# Altium project HeartBlink v1.1.PrjPCB
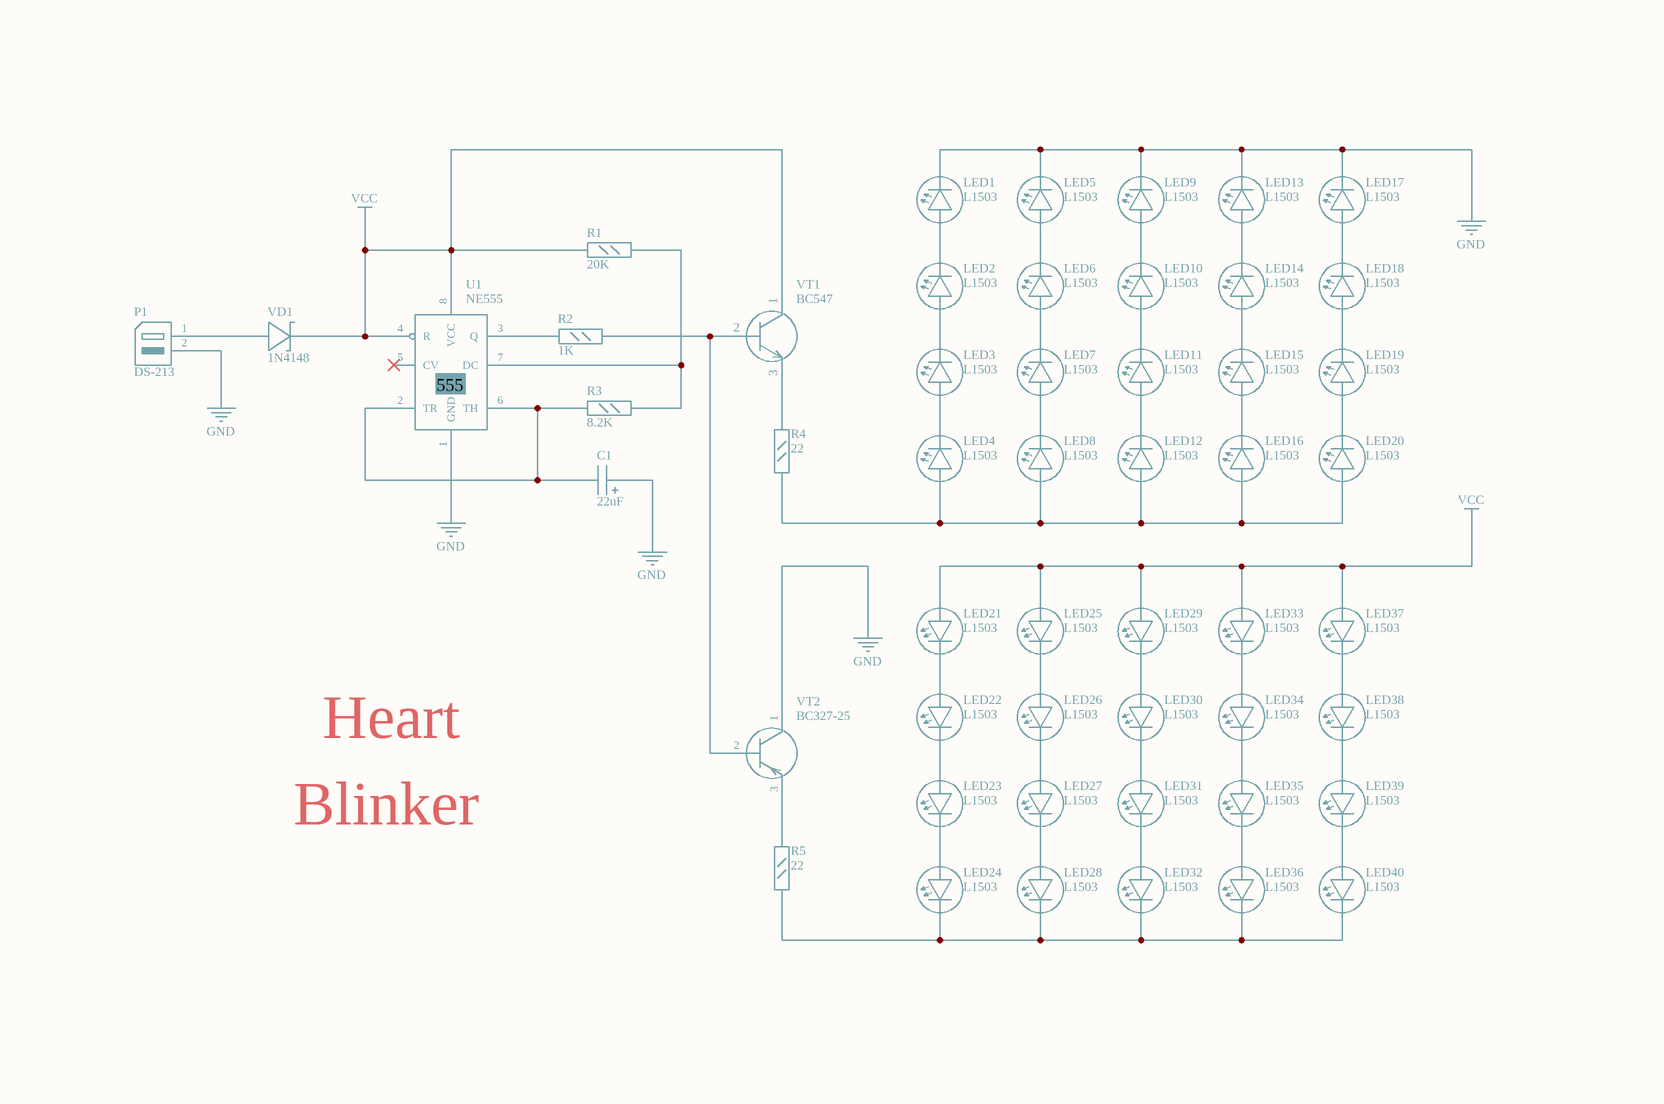
[diagram p0: HeartBlink.SchDoc]
1 sheet, 51 parts. Net scope: global (net labels, ports and power ports of the same name join across sheets).
Board file: HeartBlink.PcbDoc

## Sheet HeartBlink.SchDoc
size A4

### Parts
C1  22uF  [CAP_POL5]
LED1  L1503  [LED2.54-5MM-RED]
LED2  L1503  [LED2.54-5MM-RED]
LED3  L1503  [LED2.54-5MM-RED]
LED4  L1503  [LED2.54-5MM-RED]
LED5  L1503  [LED2.54-5MM-RED]
LED6  L1503  [LED2.54-5MM-RED]
LED7  L1503  [LED2.54-5MM-RED]
LED8  L1503  [LED2.54-5MM-RED]
LED9  L1503  [LED2.54-5MM-RED]
LED10  L1503  [LED2.54-5MM-RED]
LED11  L1503  [LED2.54-5MM-RED]
LED12  L1503  [LED2.54-5MM-RED]
LED13  L1503  [LED2.54-5MM-RED]
LED14  L1503  [LED2.54-5MM-RED]
LED15  L1503  [LED2.54-5MM-RED]
LED16  L1503  [LED2.54-5MM-RED]
LED17  L1503  [LED2.54-5MM-RED]
LED18  L1503  [LED2.54-5MM-RED]
LED19  L1503  [LED2.54-5MM-RED]
LED20  L1503  [LED2.54-5MM-RED]
LED21  L1503  [LED2.54-5MM-RED]
LED22  L1503  [LED2.54-5MM-RED]
LED23  L1503  [LED2.54-5MM-RED]
LED24  L1503  [LED2.54-5MM-RED]
LED25  L1503  [LED2.54-5MM-RED]
LED26  L1503  [LED2.54-5MM-RED]
LED27  L1503  [LED2.54-5MM-RED]
LED28  L1503  [LED2.54-5MM-RED]
LED29  L1503  [LED2.54-5MM-RED]
LED30  L1503  [LED2.54-5MM-RED]
LED31  L1503  [LED2.54-5MM-RED]
LED32  L1503  [LED2.54-5MM-RED]
LED33  L1503  [LED2.54-5MM-RED]
LED34  L1503  [LED2.54-5MM-RED]
LED35  L1503  [LED2.54-5MM-RED]
LED36  L1503  [LED2.54-5MM-RED]
LED37  L1503  [LED2.54-5MM-RED]
LED38  L1503  [LED2.54-5MM-RED]
LED39  L1503  [LED2.54-5MM-RED]
LED40  L1503  [LED2.54-5MM-RED]
P1  DS-213  [ST-213]
R1  20K  [AXIAL10R]
R2  1K  [AXIAL10R]
R3  8.2K  [AXIAL10R]
R4  22  [AXIAL10R]
R5  22  [AXIAL10R]
U1  NE555  [SOIC8]
VD1  1N4148  [AXIAL10D-BL]
VT1  BC547  [TO-92]
VT2  BC327-25  [TO-92]

### Nets
GND: C1.1 LED1.2 LED5.2 LED9.2 LED13.2 LED17.2 P1.2 U1.1(GND) VT2.1
VCC: LED21.1 LED25.1 LED29.1 LED33.1 LED37.1 R1.2 U1.4(R) U1.8(VCC) VD1.2 VT1.1
NetC1_2: C1.2 R3.2 U1.2(TR) U1.6(TH)
NetLED1_1: LED1.1 LED2.2
NetLED2_1: LED2.1 LED3.2
NetLED3_1: LED3.1 LED4.2
NetLED4_1: LED4.1 LED8.1 LED12.1 LED16.1 LED20.1 R4.1
NetLED5_1: LED5.1 LED6.2
NetLED6_1: LED6.1 LED7.2
NetLED7_1: LED7.1 LED8.2
NetLED9_1: LED9.1 LED10.2
NetLED10_1: LED10.1 LED11.2
NetLED11_1: LED11.1 LED12.2
NetLED13_1: LED13.1 LED14.2
NetLED14_1: LED14.1 LED15.2
NetLED15_1: LED15.1 LED16.2
NetLED17_1: LED17.1 LED18.2
NetLED18_1: LED18.1 LED19.2
NetLED19_1: LED19.1 LED20.2
NetLED21_2: LED21.2 LED22.1
NetLED22_2: LED22.2 LED23.1
NetLED23_2: LED23.2 LED24.1
NetLED24_2: LED24.2 LED28.2 LED32.2 LED36.2 LED40.2 R5.1
NetLED25_2: LED25.2 LED26.1
NetLED26_2: LED26.2 LED27.1
NetLED27_2: LED27.2 LED28.1
NetLED29_2: LED29.2 LED30.1
NetLED30_2: LED30.2 LED31.1
NetLED31_2: LED31.2 LED32.1
NetLED33_2: LED33.2 LED34.1
NetLED34_2: LED34.2 LED35.1
NetLED35_2: LED35.2 LED36.1
NetLED37_2: LED37.2 LED38.1
NetLED38_2: LED38.2 LED39.1
NetLED39_2: LED39.2 LED40.1
NetP1_1: P1.1 VD1.1
NetR1_1: R1.1 R3.1 U1.7(DC)
NetR2_1: R2.1 U1.3(Q)
NetR2_2: R2.2 VT1.2 VT2.2
NetR4_2: R4.2 VT1.3
NetR5_2: R5.2 VT2.3

Not connected (* = marked no-connect by the designer): U1 5(CV)*

### Notes on the sheet
- Heart
- Blinker
- (in symbol NE555) 555 /

### Library data of the parts
C1 = Cap_Pol: Value: 22uF
LED1-LED40 = Led: Name: L1503
P1 = CHOP2_P: Name: DS-213
R1-R5 = Res
  R1: Value: 20K
  R2: Value: 1K
  R3: Value: 8.2K
  R4 R5: Value: 22
VD1 = Diode_Sc: Name: 1N4148
VT1 = NPN_CBE: Name: BC547
VT2 = PNP_CBE: Name: BC327-25
U1 = NE555: Name: NE555